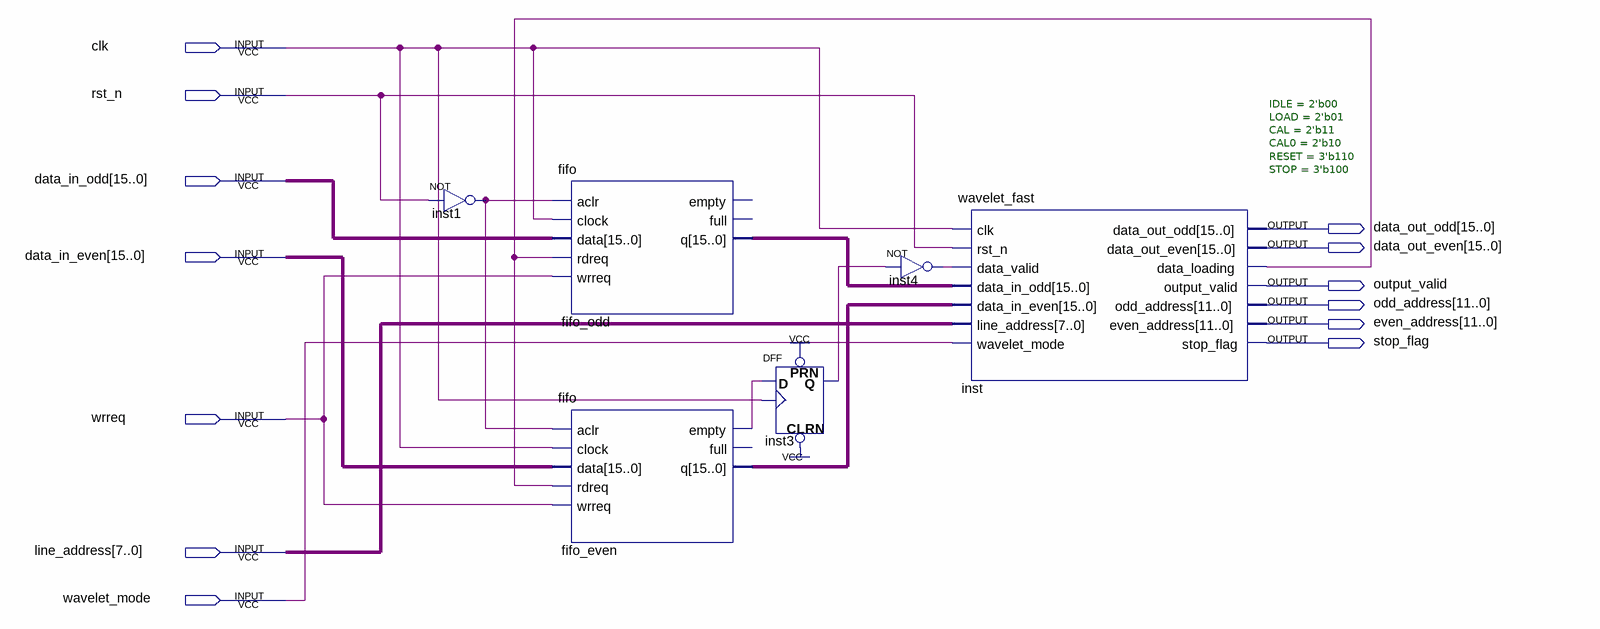
[diagram p0: schematic sheet]
// Quartus schematic wavelet_queue.bdf as structural Verilog: 6 symbols, 13 pins
module wavelet_queue (
  input  clk,
  input  rst_n,
  input  [15:0] data_in_odd,
  input  [15:0] data_in_even,
  input  wrreq,
  input  [7:0] line_address,
  input  wavelet_mode,
  output [15:0] data_out_odd,
  output [15:0] data_out_even,
  output output_valid,
  output [11:0] odd_address,
  output [11:0] even_address,
  output stop_flag
);

  wire fifo_even_empty, inst1_out, inst3_q, inst4_out, inst_data_loading;
  wire [15:0] fifo_even_q, fifo_odd_q;

  not inst1 (inst1_out, rst_n);
  fifo fifo_odd (
    .aclr(inst1_out), .clock(clk), .data(data_in_odd), .rdreq(inst_data_loading), .wrreq(wrreq),
    .q(fifo_odd_q));  // open: empty, full
  fifo fifo_even (
    .aclr(inst1_out), .clock(clk), .data(data_in_even), .rdreq(inst_data_loading), .wrreq(wrreq),
    .empty(fifo_even_empty), .q(fifo_even_q));  // open: full
  DFF inst3 (.CLRN(1'b1), .CLK(clk), .D(fifo_even_empty), .PRN(1'b1), .Q(inst3_q));
  not inst4 (inst4_out, inst3_q);
  wavelet_fast #(.IDLE(2'b00), .LOAD(2'b01), .CAL(2'b11), .CAL0(2'b10), .RESET(3'b110), .STOP(3'b100)) inst (
    .clk(clk), .rst_n(rst_n), .data_valid(inst4_out), .data_in_odd(fifo_odd_q), .data_in_even(fifo_even_q),
    .line_address(line_address), .wavelet_mode(wavelet_mode), .data_out_odd(data_out_odd),
    .data_out_even(data_out_even), .data_loading(inst_data_loading), .output_valid(output_valid),
    .odd_address(odd_address), .even_address(even_address), .stop_flag(stop_flag));
endmodule
